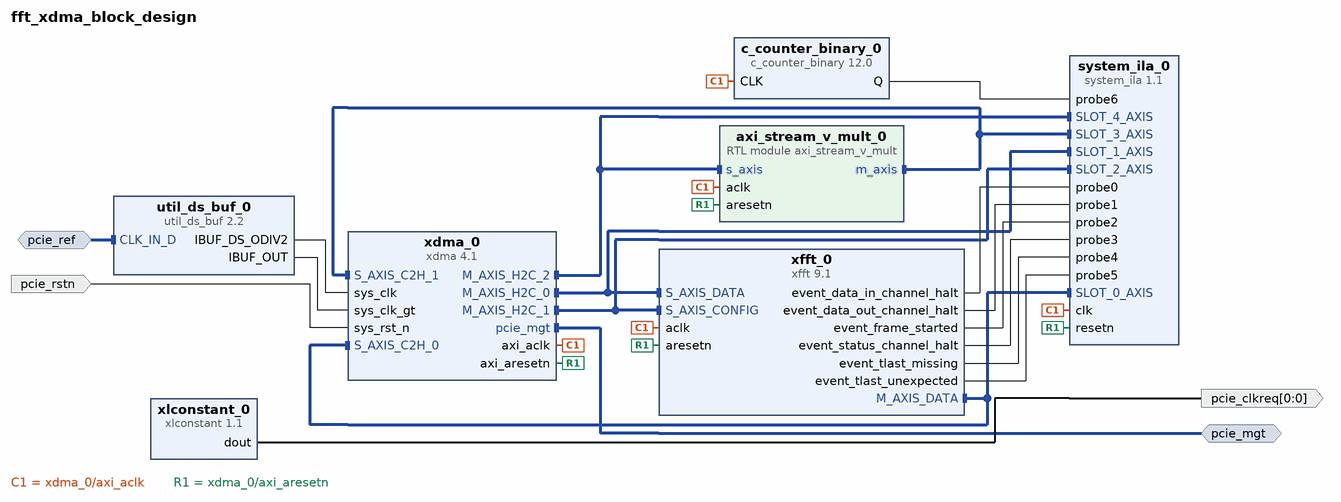
[diagram p0: block diagram of the top level]
# Vivado block design fft_xdma_block_design, xczu19eg-ffvc1760-2-i, Vivado 2023.2
create_bd_design fft_xdma_block_design

create_bd_intf_port -mode Slave -vlnv xilinx.com:interface:diff_clock_rtl:1.0 pcie_ref
create_bd_intf_port -mode Master -vlnv xilinx.com:interface:pcie_7x_mgt_rtl:1.0 pcie_mgt
create_bd_port -dir O -from 0 -to 0 pcie_clkreq
create_bd_port -dir I -type rst pcie_rstn

create_bd_cell -type ip -vlnv xilinx.com:ip:xfft:9.1 xfft_0
set_property -dict [list \
  CONFIG.aclken false \
  CONFIG.aresetn true \
  CONFIG.channels 1 \
  CONFIG.data_format floating_point \
  CONFIG.implementation_options pipelined_streaming_io \
  CONFIG.number_of_stages_using_block_ram_for_data_and_phase_factors 4 \
  CONFIG.output_ordering natural_order \
  CONFIG.phase_factor_width 24 \
  CONFIG.run_time_configurable_transform_length true \
  CONFIG.target_clock_frequency 250 \
  CONFIG.target_data_throughput 50 \
  CONFIG.transform_length 2048 \
] [get_bd_cells xfft_0]
create_bd_cell -type ip -vlnv xilinx.com:ip:xdma:4.1 xdma_0
set_property -dict [list \
  CONFIG.axilite_master_en false \
  CONFIG.drp_clk_sel Internal \
  CONFIG.en_gt_selection true \
  CONFIG.enable_jtag_dbg false \
  CONFIG.enable_mark_debug false \
  CONFIG.enable_pcie_debug_ports False \
  CONFIG.functional_mode DMA \
  CONFIG.mode_selection Advanced \
  CONFIG.pcie_blk_locn X0Y2 \
  CONFIG.pf0_link_status_slot_clock_config true \
  CONFIG.pl_link_cap_max_link_speed 5.0_GT/s \
  CONFIG.pl_link_cap_max_link_width X2 \
  CONFIG.ref_clk_freq 100_MHz \
  CONFIG.select_quad GTY_Quad_128 \
  CONFIG.xdma_axi_intf_mm AXI_Stream \
  CONFIG.xdma_axilite_slave true \
  CONFIG.xdma_pcie_64bit_en false \
  CONFIG.xdma_rnum_chnl 3 \
  CONFIG.xdma_sts_ports false \
  CONFIG.xdma_wnum_chnl 2 \
] [get_bd_cells xdma_0]
create_bd_cell -type ip -vlnv xilinx.com:ip:xlconstant:1.1 xlconstant_0
set_property -dict {CONFIG.CONST_VAL 0} [get_bd_cells xlconstant_0]
create_bd_cell -type ip -vlnv xilinx.com:ip:util_ds_buf:2.2 util_ds_buf_0
set_property -dict {CONFIG.C_BUF_TYPE IBUFDSGTE} [get_bd_cells util_ds_buf_0]
create_bd_cell -type ip -vlnv xilinx.com:ip:system_ila:1.1 system_ila_0
set_property -dict [list \
  CONFIG.ALL_PROBE_SAME_MU_CNT 1 \
  CONFIG.C_MON_TYPE MIX \
  CONFIG.C_NUM_MONITOR_SLOTS 6 \
  CONFIG.C_NUM_OF_PROBES 7 \
  CONFIG.C_PROBE0_TYPE 0 \
  CONFIG.C_PROBE1_TYPE 0 \
  CONFIG.C_PROBE2_TYPE 0 \
  CONFIG.C_PROBE3_TYPE 0 \
  CONFIG.C_PROBE4_TYPE 0 \
  CONFIG.C_PROBE5_TYPE 0 \
  CONFIG.C_PROBE6_TYPE 0 \
  CONFIG.C_SLOT_0_APC_EN 1 \
  CONFIG.C_SLOT_0_AXI_DATA_SEL 1 \
  CONFIG.C_SLOT_0_AXI_TRIG_SEL 1 \
  CONFIG.C_SLOT_0_INTF_TYPE xilinx.com:interface:axis_rtl:1.0 \
  CONFIG.C_SLOT_0_TYPE 1 \
  CONFIG.C_SLOT_1_APC_EN 1 \
  CONFIG.C_SLOT_1_AXI_DATA_SEL 1 \
  CONFIG.C_SLOT_1_AXI_TRIG_SEL 1 \
  CONFIG.C_SLOT_1_INTF_TYPE xilinx.com:interface:axis_rtl:1.0 \
  CONFIG.C_SLOT_1_TYPE 1 \
  CONFIG.C_SLOT_2_APC_EN 1 \
  CONFIG.C_SLOT_2_AXI_DATA_SEL 1 \
  CONFIG.C_SLOT_2_AXI_TRIG_SEL 1 \
  CONFIG.C_SLOT_2_INTF_TYPE xilinx.com:interface:axis_rtl:1.0 \
  CONFIG.C_SLOT_2_TYPE 1 \
  CONFIG.C_SLOT_3_APC_EN 0 \
  CONFIG.C_SLOT_3_AXI_DATA_SEL 1 \
  CONFIG.C_SLOT_3_AXI_TRIG_SEL 1 \
  CONFIG.C_SLOT_3_INTF_TYPE xilinx.com:interface:axis_rtl:1.0 \
  CONFIG.C_SLOT_3_TYPE 1 \
  CONFIG.C_SLOT_4_APC_EN 0 \
  CONFIG.C_SLOT_4_AXI_DATA_SEL 1 \
  CONFIG.C_SLOT_4_AXI_TRIG_SEL 1 \
  CONFIG.C_SLOT_4_INTF_TYPE xilinx.com:interface:axis_rtl:1.0 \
  CONFIG.C_SLOT_5_APC_EN 1 \
  CONFIG.C_SLOT_5_AXI_DATA_SEL 1 \
  CONFIG.C_SLOT_5_AXI_TRIG_SEL 1 \
  CONFIG.C_SLOT_5_INTF_TYPE xilinx.com:interface:axis_rtl:1.0 \
  CONFIG.C_TRIGIN_EN false \
  CONFIG.C_TRIGOUT_EN false \
] [get_bd_cells system_ila_0]
create_bd_cell -type module -reference axi_stream_v_mult axi_stream_v_mult_0
create_bd_cell -type ip -vlnv xilinx.com:ip:c_counter_binary:12.0 c_counter_binary_0
set_property -dict {CONFIG.Output_Width 32} [get_bd_cells c_counter_binary_0]

# ---- connections ----

connect_bd_intf_net -intf_net axi_stream_v_mult_0_m_axis [get_bd_intf_pins axi_stream_v_mult_0/m_axis] [get_bd_intf_pins xdma_0/S_AXIS_C2H_1]
connect_bd_intf_net [get_bd_intf_pins axi_stream_v_mult_0/m_axis] [get_bd_intf_pins system_ila_0/SLOT_3_AXIS]
connect_bd_intf_net [get_bd_intf_ports pcie_ref] [get_bd_intf_pins util_ds_buf_0/CLK_IN_D]
connect_bd_intf_net -intf_net xdma_0_M_AXIS_H2C_0 [get_bd_intf_pins xdma_0/M_AXIS_H2C_0] [get_bd_intf_pins xfft_0/S_AXIS_DATA]
connect_bd_intf_net [get_bd_intf_pins xdma_0/M_AXIS_H2C_0] [get_bd_intf_pins system_ila_0/SLOT_1_AXIS]
connect_bd_intf_net -intf_net xdma_0_M_AXIS_H2C_1 [get_bd_intf_pins xdma_0/M_AXIS_H2C_1] [get_bd_intf_pins xfft_0/S_AXIS_CONFIG]
connect_bd_intf_net [get_bd_intf_pins xdma_0/M_AXIS_H2C_1] [get_bd_intf_pins system_ila_0/SLOT_2_AXIS]
connect_bd_intf_net -intf_net xdma_0_M_AXIS_H2C_2 [get_bd_intf_pins xdma_0/M_AXIS_H2C_2] [get_bd_intf_pins axi_stream_v_mult_0/s_axis]
connect_bd_intf_net [get_bd_intf_pins xdma_0/M_AXIS_H2C_2] [get_bd_intf_pins system_ila_0/SLOT_4_AXIS]
connect_bd_intf_net [get_bd_intf_ports pcie_mgt] [get_bd_intf_pins xdma_0/pcie_mgt]
connect_bd_intf_net -intf_net xfft_0_M_AXIS_DATA [get_bd_intf_pins xdma_0/S_AXIS_C2H_0] [get_bd_intf_pins xfft_0/M_AXIS_DATA]
connect_bd_intf_net [get_bd_intf_pins xdma_0/S_AXIS_C2H_0] [get_bd_intf_pins system_ila_0/SLOT_0_AXIS]
connect_bd_net -net Q [get_bd_pins c_counter_binary_0/Q] [get_bd_pins system_ila_0/probe6]
connect_bd_net -net event_data_in_channel_halt [get_bd_pins xfft_0/event_data_in_channel_halt] [get_bd_pins system_ila_0/probe0]
connect_bd_net -net event_data_out_channel_halt [get_bd_pins xfft_0/event_data_out_channel_halt] [get_bd_pins system_ila_0/probe1]
connect_bd_net -net event_frame_started [get_bd_pins xfft_0/event_frame_started] [get_bd_pins system_ila_0/probe2]
connect_bd_net -net event_status_channel_halt [get_bd_pins xfft_0/event_status_channel_halt] [get_bd_pins system_ila_0/probe3]
connect_bd_net -net event_tlast_missing [get_bd_pins xfft_0/event_tlast_missing] [get_bd_pins system_ila_0/probe4]
connect_bd_net -net event_tlast_unexpected [get_bd_pins xfft_0/event_tlast_unexpected] [get_bd_pins system_ila_0/probe5]
connect_bd_net [get_bd_ports pcie_rstn] [get_bd_pins xdma_0/sys_rst_n]
connect_bd_net [get_bd_pins util_ds_buf_0/IBUF_DS_ODIV2] [get_bd_pins xdma_0/sys_clk]
connect_bd_net [get_bd_pins util_ds_buf_0/IBUF_OUT] [get_bd_pins xdma_0/sys_clk_gt]
connect_bd_net [get_bd_pins xdma_0/axi_aclk] \
  [get_bd_pins xfft_0/aclk] [get_bd_pins system_ila_0/clk] [get_bd_pins axi_stream_v_mult_0/aclk] \
  [get_bd_pins c_counter_binary_0/CLK]
connect_bd_net [get_bd_pins xdma_0/axi_aresetn] \
  [get_bd_pins system_ila_0/resetn] [get_bd_pins xfft_0/aresetn] [get_bd_pins axi_stream_v_mult_0/aresetn]
connect_bd_net [get_bd_pins xlconstant_0/dout] [get_bd_ports pcie_clkreq]
set_property HDL_ATTRIBUTE.DEBUG true [get_bd_intf_nets axi_stream_v_mult_0_m_axis]
set_property HDL_ATTRIBUTE.MARK_DEBUG true [get_bd_intf_nets axi_stream_v_mult_0_m_axis]
set_property HDL_ATTRIBUTE.DEBUG true [get_bd_intf_nets xdma_0_M_AXIS_H2C_0]
set_property HDL_ATTRIBUTE.MARK_DEBUG true [get_bd_intf_nets xdma_0_M_AXIS_H2C_0]
set_property HDL_ATTRIBUTE.DEBUG true [get_bd_intf_nets xdma_0_M_AXIS_H2C_1]
set_property HDL_ATTRIBUTE.MARK_DEBUG true [get_bd_intf_nets xdma_0_M_AXIS_H2C_1]
set_property HDL_ATTRIBUTE.DEBUG true [get_bd_intf_nets xdma_0_M_AXIS_H2C_2]
set_property HDL_ATTRIBUTE.MARK_DEBUG true [get_bd_intf_nets xdma_0_M_AXIS_H2C_2]
set_property HDL_ATTRIBUTE.DEBUG true [get_bd_intf_nets xfft_0_M_AXIS_DATA]
set_property HDL_ATTRIBUTE.MARK_DEBUG true [get_bd_intf_nets xfft_0_M_AXIS_DATA]
set_property HDL_ATTRIBUTE.DEBUG true [get_bd_nets Q]
set_property HDL_ATTRIBUTE.MARK_DEBUG true [get_bd_nets Q]
set_property HDL_ATTRIBUTE.DEBUG true [get_bd_nets event_data_in_channel_halt]
set_property HDL_ATTRIBUTE.MARK_DEBUG true [get_bd_nets event_data_in_channel_halt]
set_property HDL_ATTRIBUTE.DEBUG true [get_bd_nets event_data_out_channel_halt]
set_property HDL_ATTRIBUTE.MARK_DEBUG true [get_bd_nets event_data_out_channel_halt]
set_property HDL_ATTRIBUTE.DEBUG true [get_bd_nets event_frame_started]
set_property HDL_ATTRIBUTE.MARK_DEBUG true [get_bd_nets event_frame_started]
set_property HDL_ATTRIBUTE.DEBUG true [get_bd_nets event_status_channel_halt]
set_property HDL_ATTRIBUTE.MARK_DEBUG true [get_bd_nets event_status_channel_halt]
set_property HDL_ATTRIBUTE.DEBUG true [get_bd_nets event_tlast_missing]
set_property HDL_ATTRIBUTE.MARK_DEBUG true [get_bd_nets event_tlast_missing]
set_property HDL_ATTRIBUTE.DEBUG true [get_bd_nets event_tlast_unexpected]
set_property HDL_ATTRIBUTE.MARK_DEBUG true [get_bd_nets event_tlast_unexpected]

validate_bd_design
save_bd_design
